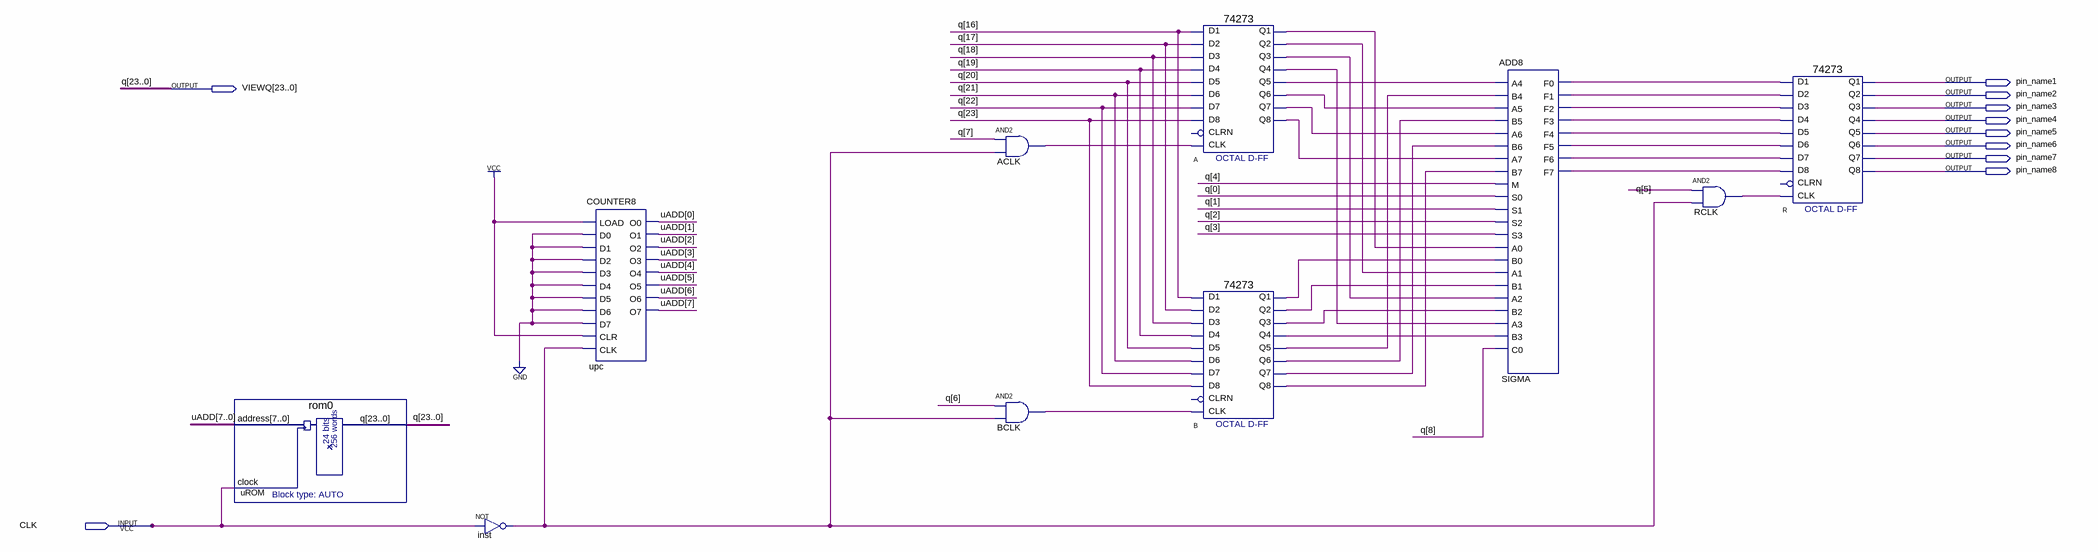
[diagram p0: schematic sheet]
// Quartus schematic exp1.bdf as structural Verilog: 10 symbols, 10 pins
module exp1 (
  input  CLK,
  output pin_name1,
  output [23:0] VIEWQ,
  output pin_name2,
  output pin_name3,
  output pin_name4,
  output pin_name5,
  output pin_name6,
  output pin_name7,
  output pin_name8
);

  wire A_q1, A_q2, A_q3, A_q4, A_q5, A_q6, A_q7, A_q8, ACLK_out, B_q1, B_q2, B_q3, B_q4, B_q5, B_q6, B_q7,
       B_q8, BCLK_out, inst_out, RCLK_out, SIGMA_f0, SIGMA_f1, SIGMA_f2, SIGMA_f3, SIGMA_f4, SIGMA_f5,
       SIGMA_f6, SIGMA_f7;
  wire [7:0] uADD;

  rom0 uROM (.address(uADD), .clock(CLK), .q(VIEWQ));
  not inst (inst_out, CLK);
  COUNTER8 upc (
    .LOAD(1'b1), .D0(1'b0), .D1(1'b0), .D2(1'b0), .D3(1'b0), .D4(1'b0), .D5(1'b0), .D6(1'b0), .D7(1'b0),
    .CLR(1'b1), .CLK(inst_out), .O0(uADD[0]), .O1(uADD[1]), .O2(uADD[2]), .O3(uADD[3]), .O4(uADD[4]),
    .O5(uADD[5]), .O6(uADD[6]), .O7(uADD[7]));
  and ACLK (ACLK_out, VIEWQ[7], inst_out);
  and BCLK (BCLK_out, VIEWQ[6], inst_out);
  \74273  A (
    .D2(VIEWQ[17]), .D3(VIEWQ[18]), .D1(VIEWQ[16]), .D4(VIEWQ[19]), .D7(VIEWQ[22]), .D6(VIEWQ[21]),
    .D5(VIEWQ[20]), .D8(VIEWQ[23]), .CLK(ACLK_out), .Q4(A_q4), .Q1(A_q1), .Q2(A_q2), .Q3(A_q3), .Q6(A_q6),
    .Q5(A_q5), .Q7(A_q7), .Q8(A_q8));  // open: CLRN
  \74273  B (
    .D2(VIEWQ[17]), .D3(VIEWQ[18]), .D1(VIEWQ[16]), .D4(VIEWQ[19]), .D7(VIEWQ[22]), .D6(VIEWQ[21]),
    .D5(VIEWQ[20]), .D8(VIEWQ[23]), .CLK(BCLK_out), .Q4(B_q4), .Q1(B_q1), .Q2(B_q2), .Q3(B_q3), .Q6(B_q6),
    .Q5(B_q5), .Q7(B_q7), .Q8(B_q8));  // open: CLRN
  ADD8 SIGMA (
    .A4(A_q5), .B4(B_q5), .A5(A_q6), .B5(B_q6), .A6(A_q7), .B6(B_q7), .A7(A_q8), .B7(B_q8), .M(VIEWQ[4]),
    .S0(VIEWQ[0]), .S1(VIEWQ[1]), .S2(VIEWQ[2]), .S3(VIEWQ[3]), .A0(A_q1), .B0(B_q1), .A1(A_q2), .B1(B_q2),
    .A2(A_q3), .B2(B_q3), .A3(A_q4), .B3(B_q4), .C0(VIEWQ[8]), .F0(SIGMA_f0), .F1(SIGMA_f1), .F2(SIGMA_f2),
    .F3(SIGMA_f3), .F4(SIGMA_f4), .F5(SIGMA_f5), .F6(SIGMA_f6), .F7(SIGMA_f7));
  and RCLK (RCLK_out, VIEWQ[5], inst_out);
  \74273  R (
    .D2(SIGMA_f1), .D3(SIGMA_f2), .D1(SIGMA_f0), .D4(SIGMA_f3), .D7(SIGMA_f6), .D6(SIGMA_f5), .D5(SIGMA_f4),
    .D8(SIGMA_f7), .CLK(RCLK_out), .Q4(pin_name4), .Q1(pin_name1), .Q2(pin_name2), .Q3(pin_name3),
    .Q6(pin_name6), .Q5(pin_name5), .Q7(pin_name7), .Q8(pin_name8));  // open: CLRN

  // Other names for the same wires on the sheet: q[23:0] = VIEWQ
endmodule
